# EasyEDA Pro project ProDocument_PCB6.epro

# Schematic Schematic4
Create Date: 2024-03-08; Page Name: P1; Project Name: 步进电机驱动板; Schematic Name: Schematic4; Update Date: 2024-05-01; Company: 嘉立创EDA; Page Size: A4; Version: V1.0
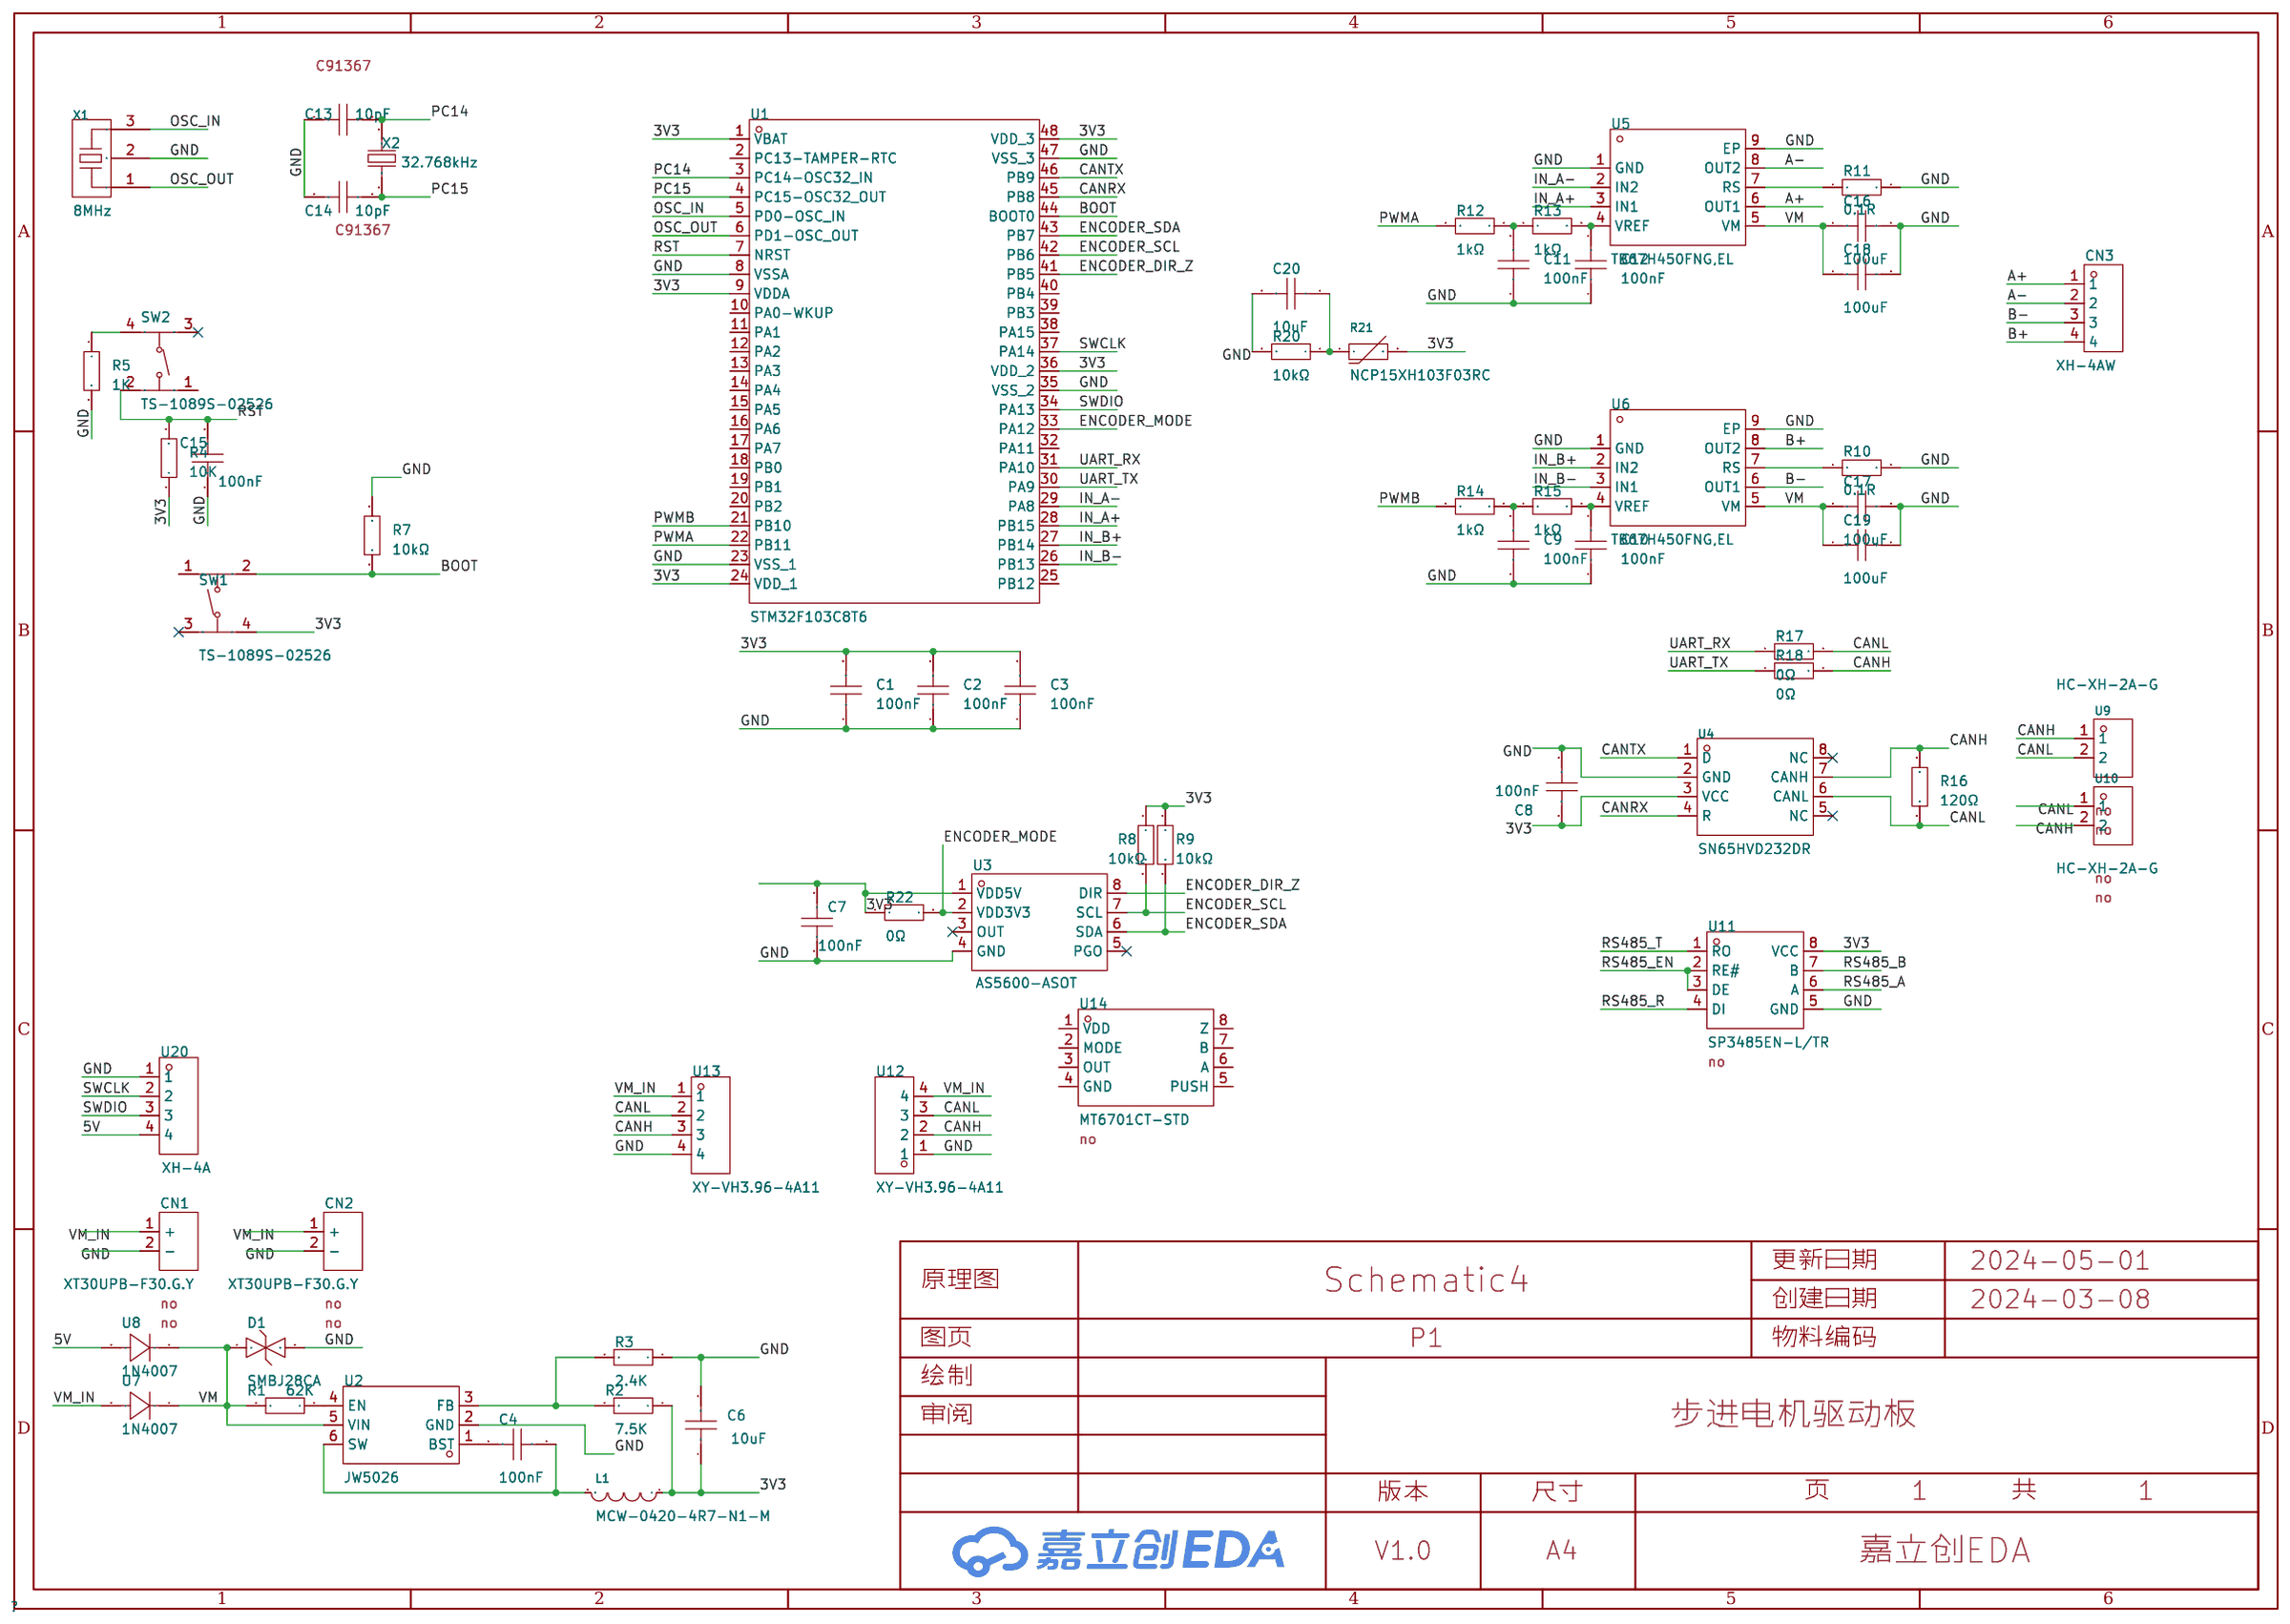
[diagram p0: schematic sheet]

## Parts
C1  100nF  [C0603]
C2  100nF  [C0603]
C3  100nF  [C0603]
C4  100nF  [C0603]
C6  10uF  [C1206]
C7  100nF  [C0603]
C8  100nF  [C0603]
C9  100nF  [C0603]
C10  100nF  [C0603]
C11  100nF  [C0603]
C12  100nF  [C0603]
C13  10pF  [C0603]
C14  10pF  [C0603]
C15  100nF  [C0603]
C16  100uF  [C1206]
C17  100uF  [C1206]
C18  100uF  [C1206]
C19  100uF  [C1206]
C20  10uF  [C0402]  (no BOM)
CN1  XT30UPB-F30.G.Y  [CONN-TH_XT30UPB-F]  (no BOM)
CN2  XT30UPB-F30.G.Y  [CONN-TH_XT30UPB-F]  (no BOM)
CN3  XH-4AW  [CONN-TH_XH-4AW]
D1  SMBJ28CA  [SMB_L4.6-W3.6-LS5.3-BI]
L1  MCW-0420-4R7-N1-M  [IND-SMD_L4.5-W4.2]
R1  62K  [R0603]
R2  7.5K  [R0603]
R3  2.4K  [R0603]
R4  10K  [R0603]
R5  1K  [R0603]
R7  10kΩ  [R0603]
R8  10kΩ  [R0603]
R9  10kΩ  [R0603]
R10  0.1R  [R1206]
R11  0.1R  [R1206]
R12  1kΩ  [R0603]
R13  1kΩ  [R0603]
R14  1kΩ  [R0603]
R15  1kΩ  [R0603]
R16  120Ω  [R0603]
R17  0Ω  [R0603]
R18  0Ω  [R0603]
R20  10kΩ  [R0402]  (no BOM)
R21  NCP15XH103F03RC  [R0402]  (no BOM)
R22  0Ω  [R0603]
SW1  TS-1089S-02526  [SW-SMD_4P-L4.2-W3.3-P2.15-LS5.1]
SW2  TS-1089S-02526  [SW-SMD_4P-L4.2-W3.3-P2.15-LS5.1]
U1  STM32F103C8T6  [LQFP-48_L7.0-W7.0-P0.50-LS9.0-BL]
U2  JW5026  [SOT-23-6_L2.9-W1.6-P0.95-LS2.8-BR]
U3  AS5600-ASOT  [SOIC-8_L5.0-W4.0-P1.27-LS6.0-BL]
U4  SN65HVD232DR  [SOIC-8_L5.0-W4.0-P1.27-LS6.0-BL]
U5  TB67H450FNG,EL  [HSOP-8_L5.0-W4.0-P1.27-LS6.2-BL-EP]
U6  TB67H450FNG,EL  [HSOP-8_L5.0-W4.0-P1.27-LS6.2-BL-EP]
U7  1N4007  [SMA_L4.3-W2.6-LS5.1-RD]
U8  1N4007  [SMA_L4.3-W2.6-LS5.1-RD]
U9  HC-XH-2A-G  [CONN-TH_2P-P2.50_HC-XH-2A-G]  (no BOM)
U10  HC-XH-2A-G  [CONN-TH_2P-P2.50_HC-XH-2A-G]  (no BOM)
U11  SP3485EN-L/TR  [SOIC-8_L5.0-W4.0-P1.27-LS6.0-BL]  (no BOM)
U12  XY-VH3.96-4A11  [CONN-TH_4P-P3.96_XYECONN_XY-VH3.96-4A11]
U13  XY-VH3.96-4A11  [CONN-TH_4P-P3.96_XYECONN_XY-VH3.96-4A11]
U14  MT6701CT-STD  [SOP-8_L4.9-W3.9-P1.27-LS6.0-BL]
U20  XH-4A  [CONN-TH_XH2.50-4P]
X1  8MHz  [OSC-SMD_3P-L3.2-W1.3-P1.2-L]
X2  32.768kHz  [OSC-SMD_L3.2-W1.5]

## Library data of the parts
C1-C3 C7-C12 C15 C20 = 0603B104K500NT: 容值:100nF;精度:±10%;额定电压:50V;材质(温度系数):X7R;; LCSC Part Name: 100nF ±10% 50V; Supplier Part: C30926; Manufacturer: FH(风华); Supplier Footprint: 0603; JLCPCB Part Class: Extended Part; Datasheet: https://atta.szlcsc.com/upload/public/pdf/source/20200305/C486355_26A10D38EF8C2A5C37091D0039909270.pdf; Supplier: LCSC; Tolerance: ±10%; Voltage Rated: 50V; Temperature Coefficient: X7R
C4 = 0603B104K500NT: 容值:100nF;精度:±10%;额定电压:50V;材质(温度系数):X7R;; LCSC Part Name: 100nF ±10% 50V; Supplier Part: C30926; Manufacturer: FH(风华); Supplier Footprint: 0603; JLCPCB Part Class: Extended Part; Datasheet: https://atta.szlcsc.com/upload/public/pdf/source/20170923/C30926_1506149436298988724.pdf; Supplier: LCSC; Tolerance: ±10%; Voltage Rated: 50V; Temperature Coefficient: X7R
C6 = CL31A106KAHNNNE: 容值:10uF;精度:±10%;额定电压:25V;材质(温度系数):X5R;; LCSC Part Name: 10uF ±10% 25V; Supplier Part: C9807; Manufacturer: SAMSUNG(三星); Supplier Footprint: 1206; JLCPCB Part Class: Extended Part; Datasheet: https://atta.szlcsc.com/upload/public/pdf/source/20160218/1457707763339.pdf; Supplier: LCSC; Tolerance: ±10%; Voltage Rated: 25V; Temperature Coefficient: X5R
C13 C14 = 0603CG100J500NT: 容值:10pF;精度:±5%;额定电压:50V;材质(温度系数):C0G;; LCSC Part Name: 10pF ±5% 50V; Supplier Part: C91367; Manufacturer: FH(风华); Supplier Footprint: 0603; JLCPCB Part Class: Extended Part; Datasheet: https://atta.szlcsc.com/upload/public/pdf/source/20170923/C91367_1506149565935988975.pdf; Supplier: LCSC; Tolerance: ±5%; Voltage Rated: 50V; Temperature Coefficient: C0G
C16-C19 = 1206B475K500NT: 容值:4.7uF;精度:±10%;额定电压:50V;材质(温度系数):X7R;; LCSC Part Name: 4.7uF ±10% 50V; Supplier Part: C29823; Manufacturer: FH(风华); Supplier Footprint: 1206; JLCPCB Part Class: Basic Part; Datasheet: https://atta.szlcsc.com/upload/public/pdf/source/20200305/C486355_26A10D38EF8C2A5C37091D0039909270.pdf; Supplier: LCSC; Tolerance: ±10%; Voltage Rated: 50V; Temperature Coefficient: X7R
CN1 CN2 = XT30UPB-F30.G.Y: 类别:-;类型1:-;; LCSC Part Name: AMASS(艾迈斯)直立焊板式连接器XT30UPB30-F.G.*; Supplier Part: C108769; Manufacturer: AMASS(艾迈斯); JLCPCB Part Class: Extended Part; Datasheet: https://atta.szlcsc.com/upload/public/pdf/source/20220715/AFD68B9E8B6CA95A7295DBF4AF9325E4.pdf; Supplier: LCSC; Brand: 艾迈斯; Type: 航模插头; Colour: 黄色; RatedVoltage: DC 500V; InterfaceType: 母头; MetalMaterial: 镀金; InsulationMaterial: PA; RatedCurrent: 15A; contact resistance: 0.65mΩ
CN3 = XH-4AW: 参考系列:XH;间距:2.54mm;插针结构:1x4P;排数:1;每排PIN数:4;行距:-;公母:公型插针;安装方式:弯插;额定电流:3A;工作温度范围:-25℃~+85℃;; LCSC Part Name: XH 2.54mm 1x4P 弯插; Supplier Part: C2908613; Manufacturer: HCTL(华灿天禄); Supplier Footprint: 插件,P=2.54mm; JLCPCB Part Class: Extended Part; Datasheet: https://atta.szlcsc.com/upload/public/pdf/source/20211021/ACA2D54D99493880102FCACAC8DAABA8.pdf; Supplier: LCSC; Reference Series: XH; Pitch: 2.54mm; Pins Structure: 1x4P; Number of Rows: 1; Number of PINs Per Row: 4; Gender: 公型插针; Mounting Style: 弯插; Current Rating (Max): 3A; Operating Temperature Range: -25℃~+85℃
D1 = SMBJ28CA_C726872: 极性：双向 反向截止电压(Vrwm)：28V 击穿电压：31.1V 最大钳位电压：45.4V; Supplier Part: C726872; Manufacturer: TWGMC(台湾迪嘉); Supplier Footprint: SMB; JLCPCB Part Class: 扩展库; Datasheet: https://atta.szlcsc.com/upload/public/pdf/source/20200901/C726811_07201DC3516E92FF13903A0BAE18F725.pdf; Supplier: LCSC
L1 = MCW-0420-4R7-N1-M: LCSC Part Name: 4.7uH ±20%; Supplier Part: C169364; Manufacturer: Hk-hotline(合泰盟方); Supplier Footprint: 0420; JLCPCB Part Class: Extended Part; Supplier: LCSC; Inductance: 10uH
R1 = 0603WAF6202T5E: 电阻类型:厚膜电阻;阻值:62kΩ;精度:±1%;功率:100mW;最大工作电压:75V;温度系数:±100ppm/℃;; LCSC Part Name: 62kΩ ±1% 100mW 厚膜电阻; Supplier Part: C23221; Manufacturer: UNI-ROYAL(厚声); Supplier Footprint: 0603; JLCPCB Part Class: Extended Part; Datasheet: https://atta.szlcsc.com/upload/public/pdf/source/20200306/C422600_1E6D84923E4A46A82E41ADD87F860B5C.pdf; Supplier: LCSC; Type: 厚膜电阻; Tolerance: ±1%; Power(Watts): 100mW; Overload Voltage (Max): 75V; Temperature Coefficient: ±100ppm/℃; Operating Temperature Range: -55℃~+155℃
R2 = 0603WAF7501T5E: 电阻类型:厚膜电阻;阻值:7.5kΩ;精度:±1%;功率:100mW;最大工作电压:75V;温度系数:±100ppm/℃;; LCSC Part Name: 7.5kΩ ±1% 100mW 厚膜电阻; Supplier Part: C23234; Manufacturer: UNI-ROYAL(厚声); Supplier Footprint: 0603; JLCPCB Part Class: Basic Part; Datasheet: https://atta.szlcsc.com/upload/public/pdf/source/20200306/C422600_1E6D84923E4A46A82E41ADD87F860B5C.pdf; Supplier: LCSC; Type: 厚膜电阻; Tolerance: ±1%; Power(Watts): 100mW; Overload Voltage (Max): 75V; Temperature Coefficient: ±100ppm/℃; Operating Temperature Range: -55℃~+155℃
R3 = 0603WAF2401T5E: 电阻类型:厚膜电阻;阻值:2.4kΩ;精度:±1%;功率:100mW;最大工作电压:75V;温度系数:±100ppm/℃;; LCSC Part Name: 2.4kΩ ±1% 100mW 厚膜电阻; Supplier Part: C22940; Manufacturer: UNI-ROYAL(厚声); Supplier Footprint: 0603; JLCPCB Part Class: Basic Part; Datasheet: https://atta.szlcsc.com/upload/public/pdf/source/20200306/C422600_1E6D84923E4A46A82E41ADD87F860B5C.pdf; Supplier: LCSC; Type: 厚膜电阻; Tolerance: ±1%; Power(Watts): 100mW; Overload Voltage (Max): 75V; Temperature Coefficient: ±100ppm/℃; Operating Temperature Range: -55℃~+155℃
R4 R7-R9 R20 = 0603WAF1002T5E: 电阻类型:厚膜电阻;阻值:10kΩ;精度:±1%;功率:100mW;最大工作电压:75V;温度系数:±100ppm/℃;; LCSC Part Name: 厚膜电阻 10kΩ ±1% 100mW; Supplier Part: C25804; Manufacturer: UNI-ROYAL(厚声); Supplier Footprint: 0603; JLCPCB Part Class: Basic Part; Datasheet: https://atta.szlcsc.com/upload/public/pdf/source/20200306/C422600_1E6D84923E4A46A82E41ADD87F860B5C.pdf; Supplier: LCSC; Type: 厚膜电阻; Tolerance: ±1%; Power(Watts): 100mW; Temperature Coefficient: ±100ppm/℃; Overload Voltage (Max): 75V; Operating Temperature Range: -55℃~+155℃
R5 R12-R15 = RC0603FR-071KL: 电阻类型:厚膜电阻;阻值:1kΩ;精度:±1%;功率:100mW;最大工作电压:75V;温度系数:±100ppm/℃;; LCSC Part Name: 厚膜电阻 1kΩ ±1% 100mW; Supplier Part: C22548; Manufacturer: YAGEO(国巨); Supplier Footprint: 0603; JLCPCB Part Class: Extended Part; Datasheet: https://atta.szlcsc.com/upload/public/pdf/source/20180316/70C0E2BDAE7FCC62C531A5A58D202EE1.pdf; Supplier: LCSC; Type: 厚膜电阻; Tolerance: ±1%; Power(Watts): 100mW; Overload Voltage (Max): 75V; Temperature Coefficient: ±100ppm/℃; Operating Temperature Range: -55℃~+155℃
R10 R11 = 1206W4F100LT5E: 电阻类型:厚膜电阻;阻值:100mΩ;精度:±1%;功率:250mW;最大工作电压:200V;温度系数:±800ppm/℃;; LCSC Part Name: 100mΩ ±1% 250mW 厚膜电阻; Supplier Part: C25334; Manufacturer: UNI-ROYAL(厚声); Supplier Footprint: 1206; JLCPCB Part Class: Basic Part; Datasheet: https://atta.szlcsc.com/upload/public/pdf/source/20200306/C422600_1E6D84923E4A46A82E41ADD87F860B5C.pdf; Supplier: LCSC; Type: 厚膜电阻; Tolerance: ±1%; Power(Watts): 250mW; Temperature Coefficient: ±800ppm/℃; Overload Voltage (Max): 200V; Operating Temperature Range: -55℃~+155℃
R16 = 0603WAF1200T5E: 电阻类型:厚膜电阻;阻值:120Ω;精度:±1%;功率:100mW;; LCSC Part Name: 120Ω ±1% 100mW; Supplier Part: C22787; Manufacturer: UNI-ROYAL(厚声); Supplier Footprint: 0603; JLCPCB Part Class: Basic Part; Datasheet: https://atta.szlcsc.com/upload/public/pdf/source/20200306/C422600_1E6D84923E4A46A82E41ADD87F860B5C.pdf; Supplier: LCSC; Type: 厚膜电阻; Tolerance: ±1%; Power(Watts): 100mW; Temperature Coefficient: ±100ppm/℃; Overload Voltage (Max): 75V; Operating Temperature Range: -55℃~+155℃
R17 R18 R22 = 0603WAF0000T5E: 电阻类型:厚膜电阻;阻值:0Ω;精度:±1%;功率:100mW;最大工作电压:75V;; LCSC Part Name: 0Ω ±1% 100mW 厚膜电阻; Supplier Part: C21189; Manufacturer: UNI-ROYAL(厚声); Supplier Footprint: 0603; JLCPCB Part Class: 基础库; Datasheet: https://atta.szlcsc.com/upload/public/pdf/source/20200306/C422600_1E6D84923E4A46A82E41ADD87F860B5C.pdf; Supplier: LCSC; Type: 厚膜电阻; Tolerance: ±1%; Power(Watts): 100mW; Overload Voltage (Max): 75V; Operating Temperature Range: -55℃~+155℃
R21 = NCP15XH103F03RC: 阻值(25℃):10kΩ;B值(25℃/50℃):3380K;电阻精度:±1%;功率:100mW;B值精度:±1%;最大稳态电流(25℃):310uA;; LCSC Part Name: 10kΩ 电阻精度:±1% 3380K; Supplier Part: C77131; Manufacturer: muRata(村田); Supplier Footprint: 0402; JLCPCB Part Class: 扩展库; Datasheet: https://atta.szlcsc.com/upload/public/pdf/source/20191017/C437581_F6360BF8E6A38281D0EED84DF6C92458.pdf; Supplier: LCSC; Resistance @ 25℃: 10kΩ; B Constant (25℃/50℃): 3380K; Resistance Tolerance: ±1%; B Constant (25℃/85℃): 3434K; B Constant (25℃/100℃): 3455K; Power: 100mW; B Constant Tolerance: ±1%; Steady State Current (Max): 310uA; Operating Temperature: -40℃~+125℃
SW1 SW2 = TS-1089S-02526: 触点电流:50mA;额定电压(DC):12V;电路结构:单刀单掷;安装方式:立贴;带灯:-;机械寿命:-;; LCSC Part Name: 4.2*3.25*2.5mm 立贴 轻触开关; Supplier Part: C455282; Manufacturer: XUNPU(讯普); Supplier Footprint: SMD,3.3x4.2mm; JLCPCB Part Class: Extended Part; Datasheet: https://atta.szlcsc.com/upload/public/pdf/source/20191118/C455282_2E86A26A9CC4FEF4662951C4D45ED672.pdf; Supplier: LCSC; Contact Current: 50mA; Voltage Rating (DC): 12V; Circuit: 单刀单掷; Mounting Style: 立贴; Actuator Style: 椭圆形按钮; Switch Length: 4.2mm; Switch Width: 3.25mm; Switch Height: 2.5mm
U1 = STM32F103C8T6: CPU内核:CM3;程序存储容量:64KB;RAM总容量:20KB;GPIO端口数量:37;工作电压范围:2V~3.6V;CPU最大主频:72MHz;程序存储器类型:FLASH;; LCSC Part Name: STM32F103C8T6 MSL=3; Supplier Part: C8734; Manufacturer: ST(意法半导体); Supplier Footprint: LQFP-48(7x7); JLCPCB Part Class: 扩展库; Datasheet: https://atta.szlcsc.com/upload/public/pdf/source/20220812/8363ACEC51AD55ECEB84799464F7CB85.pdf; Supplier: LCSC; CPU Core: CM3; Program Storage Size: 64KB; RAM Size: 20KB; GPIO Ports Number: 37; Operating Voltage Range: 2V~3.6V; CPU Maximum Speed: 72MHz; Program Memory Type: FLASH; Operating Temperature Range: -40℃~+85℃; ADC (Bit): 12bit; Universal Serial Bus: 有; Peripheral/Function: 看门狗；DMA；看门狗；片载温度传感器; Watchdog: 有; Infrared Data Association: 有; Low-Voltage Detect: 有; Direct Memory Access: 有; Internal Oscillator: 有
U2 = JW5026: 功能类型:降压型;输入电压:-;输出电流(最大值):-;; Supplier Part: C185109; Manufacturer: Joulwatt(杰华特); Supplier Footprint: SOT-23-6; JLCPCB Part Class: 扩展库; Datasheet: https://atta.szlcsc.com/upload/public/pdf/source/20240125/2964151177DE342668C6C754847A8D5A.pdf; Supplier: LCSC; Function: 降压型; Switch tube (built-in/external): 内置
U3 = AS5600-ASOT: Supplier Part: C499458; Manufacturer: ams(艾迈斯半导体); Supplier Footprint: SOIC-8; JLCPCB Part Class: Extended Part; Datasheet: https://atta.szlcsc.com/upload/public/pdf/source/20200324/C499458_E1461AFB0CE1042DE5756821C534625C.pdf; Supplier: LCSC
U4 = SN65HVD232DR: 类型:收发器;数据速率:1Mbps;; LCSC Part Name: 1Mbps 3V~3.6V; Supplier Part: C30530; Manufacturer: TI(德州仪器); Supplier Footprint: SOIC-8; JLCPCB Part Class: 扩展库; Datasheet: https://www.ti.com/cn/lit/gpn/sn65hvd230; Supplier: LCSC; Type: 收发器; Data Rate: 1Mbps; Supply Voltage: 3V~3.6V; Operating Temperature: -40℃~+85℃
U5 U6 = TB67H450FNG,EL: Supplier Part: C545417; Manufacturer: TOSHIBA(东芝); Supplier Footprint: HSOP-8-EP; JLCPCB Part Class: 扩展库; Datasheet: https://atta.szlcsc.com/upload/public/pdf/source/20211227/C3DC112555A020FEF41243C8668D1DC3.pdf; Supplier: LCSC
U7 U8 = 1N4007: Supplier Part: C9900004759; JLCPCB Part Class: Extended Part; Supplier: LCSC
U9 U10 = HC-XH-2A-G: 参考系列:XH;间距:2.54mm;插针结构:1x2P;排数:1;每排PIN数:2;行距:2.54mm;公母:公型插针;安装方式:直插;额定电流:3A;工作温度范围:-25℃~+85℃;; LCSC Part Name: XH 2.54mm 1x2P 直插; Supplier Part: C5341201; Manufacturer: HCTL(华灿天禄); Supplier Footprint: 插件,P=2.5mm; JLCPCB Part Class: Extended Part; Datasheet: https://atta.szlcsc.com/upload/public/pdf/source/20230105/4FFD2EFD3DA44AA828171A44400F3EDE.pdf; Supplier: LCSC; Reference Series: XH; Pitch: 2.54mm; Pins Structure: 1x2P; Number of Rows: 1; Number of PINs Per Row: 2; Row Spacing: 2.54mm; Gender: 公型插针; Mounting Style: 直插; Current Rating (Max): 3A; Operating Temperature Range: -25℃~+85℃
U11 = SP3485EN-L/TR: 类型:收发器;数据速率:10Mbps;驱动器/接收器:1/1;; LCSC Part Name: 3.3V供电 10Mbps 收发器; Supplier Part: C8963; Manufacturer: MaxLinear(迈凌); Supplier Footprint: SOIC-8; JLCPCB Part Class: 基础库; Datasheet: https://atta.szlcsc.com/upload/public/pdf/source/20170601/1496285796963.pdf; Supplier: LCSC; Types: 收发器; Supply Voltage: 3.3V; Data Rate: 10Mbps; Driver/receiver: 1/1; Operating Temperature: -40℃~+85℃
U12 U13 = XY-VH3.96-4A11: 插针结构:1x4P;间距:3.96mm;安装方式:直插;总PIN数:4P;排数:1;每排PIN数:4;行距:3.96mm;额定电流:3A;工作温度范围:-25℃~+85℃;; LCSC Part Name: 1x4P 间距:3.96mm 直插; Supplier Part: C19271415; Manufacturer: XYECONN(辛译); Supplier Footprint: 插件,P=3.96mm; Datasheet: https://atta.szlcsc.com/upload/public/pdf/source/20240124/3351DCBDBDC6C4968837212D831D20D7.pdf; Supplier: LCSC; Pins Structure: 1x4P; Pitch: 3.96mm; Mounting Style: 直插; Number of Pins: 4P; Number of Rows: 1; Number of PINs Per Row: 4; Row Spacing: 3.96mm; Current Rating (Max): 3A; Operating Temperature Range: -25℃~+85℃
U14 = MT6701CT-STD_C5451785: Supplier Part: C5451785; Manufacturer: MagnTek(麦歌恩); Supplier Footprint: SOP-8; JLCPCB Part Class: Extended Part; Supplier: LCSC
U20 = XH-4A_C2908602: 参考系列:XH;间距:2.5mm;插针结构:1x4P;排数:1;每排PIN数:4;行距:-;公母:公型插针;安装方式:直插;额定电流:3A;工作温度范围:-25℃~+85℃;; LCSC Part Name: XH 2.5mm 1x4P 直插; Supplier Part: C2908602; Manufacturer: HCTL(华灿天禄); Supplier Footprint: 插件,P=2.5mm; JLCPCB Part Class: Extended Part; Datasheet: https://atta.szlcsc.com/upload/public/pdf/source/20211021/653319DEFF6FA72D109D92786067BD8A.pdf; Supplier: LCSC; Reference Series: XH; Pitch: 2.5mm; Pins Structure: 1x4P; Number of Rows: 1; Number of PINs Per Row: 4; Gender: 公型插针; Mounting Style: 直插; Current Rating (Max): 3A; Operating Temperature Range: -25℃~+85℃
X1 = CSTCE8M00G15C99-R0: 频率:8MHz;内置负载电容:33pF;谐振阻抗:40Ω;; LCSC Part Name: 8MHz ±0.1% 内置负载电容:33pF; Supplier Part: C110614; Manufacturer: muRata(村田); Supplier Footprint: SMD3213-3P; JLCPCB Part Class: 扩展库; Datasheet: https://atta.szlcsc.com/upload/public/pdf/source/20180327/C110614_9F5031E08ADB10DE4472527BF78A8CAF.pdf; Supplier: LCSC; Built-in Load Capacitance: 33pF; Resonant Impedance: 40Ω; Operating Temperature: -40℃~+125℃
X2 = X321532768KGD2SI: 晶振类型:贴片晶振;频率:32.768kHz;常温频差:±20ppm;外接负载电容:12.5pF;; LCSC Part Name: 32.768kHz ±20ppm 12.5pF; Supplier Part: C620155; Manufacturer: YXC(扬兴晶振); Supplier Footprint: SMD3215-2P; JLCPCB Part Class: Extended Part; Datasheet: https://atta.szlcsc.com/upload/public/pdf/source/20210329/C620155_E5A74FC0D27C5E9015A8D75DE9484FEA.pdf; Supplier: LCSC; Crystal Type: 贴片晶振; Normal temperature Frequency Tolerance: ±20ppm; External load capacitor: 12.5pF; Operating Temperature: -40℃~+85℃; Frequency Tolerance: ±20ppm; Load Capacitance: 12.5pF; Equivalent Series Resistance (ESR): 70kΩ

## Nets
3V3: C1.2 C2.2 C3.2 C6.1 C7.2 C8.2 L1.1 R2.1 R4.1 R8.1 R9.1 R21.2 R22.1 SW1.4 U1.1(VBAT) U1.9(VDDA) U1.24(VDD_1) U1.36(VDD_2) U1.48(VDD_3) U3.1(VDD5V) U4.3(VCC) U11.8(VCC)
5V: U8.2(A) U20.4
GND: C1.1 C2.1 C3.1 C6.2 C7.1 C8.1 C9.1 C10.1 C11.1 C12.1 C13.1 C14.1 C15.1 C16.2 C17.2 C18.2 C19.2 C20.2 CN1.2(-) CN2.2(-) D1.2 R3.1 R5.2 R7.1 R10.2 R11.2 R20.2 U1.8(VSSA) U1.23(VSS_1) U1.35(VSS_2) U1.47(VSS_3) U2.2(GND) U3.4(GND) U4.2(GND) U5.1(GND) U5.9(EP) U6.1(GND) U6.9(EP) U11.5(GND) U12.1 U13.4 U20.1 X1.2
A+: CN3.1 U5.6(OUT1)
A-: CN3.2 U5.8(OUT2)
B+: CN3.4 U6.8(OUT2)
B-: CN3.3 U6.6(OUT1)
BOOT: R7.2 SW1.2 U1.44(BOOT0)
CANH: R16.2 R18.2 U4.7(CANH) U9.1 U10.2 U12.2 U13.3
CANL: R16.1 R17.2 U4.6(CANL) U9.2 U10.1 U12.3 U13.2
CANRX: U1.45(PB8) U4.4(R)
CANTX: U1.46(PB9) U4.1(D)
ENCODER_DIR_Z: U1.41(PB5) U3.8(DIR)
ENCODER_MODE: R22.2 U1.33(PA12) U3.2(VDD3V3)
ENCODER_SCL: R8.2 U1.42(PB6) U3.7(SCL)
ENCODER_SDA: R9.2 U1.43(PB7) U3.6(SDA)
IN_A+: U1.28(PB15) U5.3(IN1)
IN_A-: U1.29(PA8) U5.2(IN2)
IN_B+: U1.27(PB14) U6.2(IN2)
IN_B-: U1.26(PB13) U6.3(IN1)
OSC_IN: U1.5(PD0-OSC_IN) X1.3
OSC_OUT: U1.6(PD1-OSC_OUT) X1.1
PC14: C13.2 U1.3(PC14-OSC32_IN) X2.2
PC15: C14.2 U1.4(PC15-OSC32_OUT) X2.1
PWMA: R12.2 U1.22(PB11)
PWMB: R14.2 U1.21(PB10)
RS485_A: U11.6(A)
RS485_B: U11.7(B)
RS485_EN: U11.2(RE#) U11.3(DE)
RS485_R: U11.4(DI)
RS485_T: U11.1(RO)
RST: C15.2 R4.2 SW2.2 U1.7(NRST)
SWCLK: U1.37(PA14) U20.2
SWDIO: U1.34(PA13) U20.3
UART_RX: R17.1 U1.31(PA10)
UART_TX: R18.1 U1.30(PA9)
VM: C16.1 C17.1 C18.1 C19.1 D1.1 R1.2 U2.5(VIN) U5.5(VM) U6.5(VM) U7.1(K) U8.1(K)
VM_IN: CN1.1(+) CN2.1(+) U7.2(A) U12.4 U13.1
Net-(C4-1): C4.1 U2.1(BST)
Net-(C4-2): C4.2 L1.2 U2.6(SW)
Net-(C9-2): C9.2 R14.1 R15.1
Net-(C10-2): C10.2 R15.2 U6.4(VREF)
Net-(C11-2): C11.2 R12.1 R13.1
Net-(C12-2): C12.2 R13.2 U5.4(VREF)
Net-(C20-1): C20.1 R20.1 R21.1
Net-(R1-1): R1.1 U2.4(EN)
Net-(R2-2): R2.2 R3.2 U2.3(FB)
Net-(R5-1): R5.1 SW2.4
Net-(R10-1): R10.1 U6.7(RS)
Net-(R11-1): R11.1 U5.7(RS)

Not connected (* = marked no-connect by the designer): SW1 1 3*; SW2 1 3*; U1 2(PC13-TAMPER-RTC) 10(PA0-WKUP) 11(PA1) 12(PA2) 13(PA3) 14(PA4) 15(PA5) 16(PA6) 17(PA7) 18(PB0) 19(PB1) 20(PB2) 25(PB12) 32(PA11) 38(PA15) 39(PB3) 40(PB4); U3 3(OUT)* 5(PGO)*; U4 5(NC)* 8(NC)*; U14 1(VDD) 2(MODE) 3(OUT) 4(GND) 5(PUSH) 6(A) 7(B) 8(Z)
